# Altium schematic sheet DRS4_GPIO_EXPANDER_MODULE.SchDoc: GPIO Exp Module
size Letter; SheetNumber: 15; SheetTotal: 32
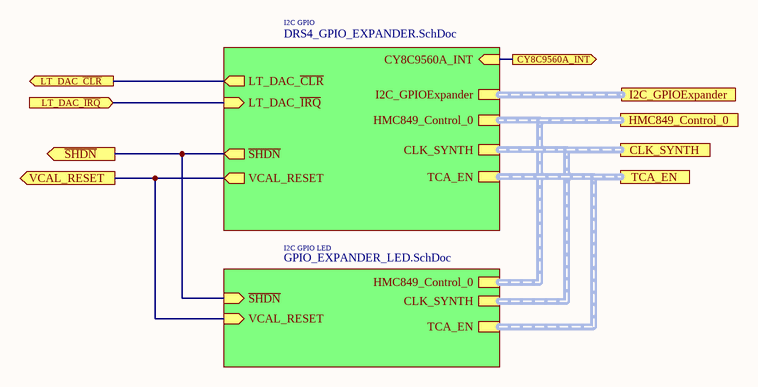
[diagram p0: DRS4_GPIO_EXPANDER_MODULE.SchDoc]

## Sub-sheets
I2C GPIO = DRS4_GPIO_EXPANDER.SchDoc: HMC849_Control_0 (harness HMC849 Control 0), I2C_GPIOExpander (harness GPIO Expander I2C), CLK_SYNTH (harness CLK SYNTH CONTROL), TCA_EN (harness TCA EN), ~{SHDN} (out), VCAL_RESET (out), LT_DAC_~{CLR} (out), LT_DAC_~{IRQ} (in), CY8C9560A_INT (in)
I2C GPIO LED = GPIO_EXPANDER_LED.SchDoc: HMC849_Control_0 (harness HMC849 Control 0), CLK_SYNTH (harness CLK SYNTH CONTROL), TCA_EN (harness TCA EN), ~{SHDN} (in), VCAL_RESET (in)

## Ports
CLK_SYNTH (harness CLK SYNTH CONTROL), CY8C9560A_INT (out), HMC849_Control_0 (harness HMC849 Control 0), I2C_GPIOExpander (harness GPIO Expander I2C), LT_DAC_~{CLR} (out), LT_DAC_~{IRQ} (in), TCA_EN (harness TCA EN), VCAL_RESET (out), ~{SHDN} (out)

## Nets
CY8C9560A_INT: port CY8C9560A_INT, sheet I2C GPIO/CY8C9560A_INT
LT_DAC_~{CLR}: port LT_DAC_~{CLR}, sheet I2C GPIO/LT_DAC_~{CLR}
LT_DAC_~{IRQ}: port LT_DAC_~{IRQ}, sheet I2C GPIO/LT_DAC_~{IRQ}
~{SHDN}: port ~{SHDN}, sheet I2C GPIO/~{SHDN}, sheet I2C GPIO LED/~{SHDN}
VCAL_RESET: port VCAL_RESET, sheet I2C GPIO/VCAL_RESET, sheet I2C GPIO LED/VCAL_RESET

## Buses and harness runs
harness port CLK_SYNTH = sheet I2C GPIO LED/CLK_SYNTH = sheet I2C GPIO/CLK_SYNTH
harness port HMC849_Control_0 = sheet I2C GPIO LED/HMC849_Control_0 = sheet I2C GPIO/HMC849_Control_0
harness port I2C_GPIOExpander = sheet I2C GPIO/I2C_GPIOExpander
harness port TCA_EN = sheet I2C GPIO LED/TCA_EN = sheet I2C GPIO/TCA_EN

## Notes on the sheet
- 475 Portola Plaza
- GAPS TOF
- Title
- igarcia91@g.ucla.edu
- Los Angeles, CA
- 310-825-0344
- Size:
- Date:
- Letter
- Number:
- Time:
- Sheet
- Revision:
- of
- andrew.peck@cern.ch
- spq@ucla.edu
- File: